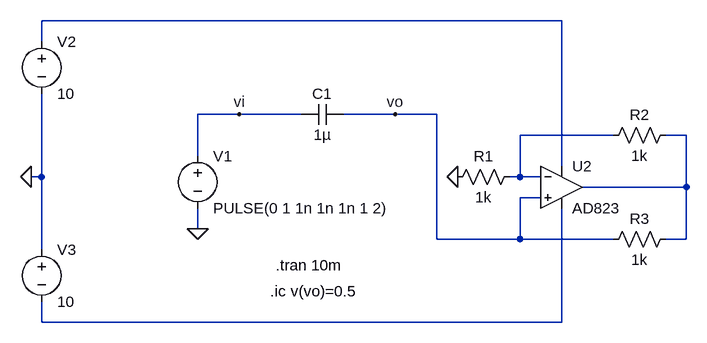
[diagram p0: schematic Q1.asc]
Q1.asc, the LTspice schematic file:
Version 4
SHEET 1 1064 680
WIRE 864 96 64 96
WIRE 64 128 64 96
WIRE 368 240 304 240
WIRE 464 240 368 240
WIRE 608 240 528 240
WIRE 672 240 608 240
WIRE 944 272 800 272
WIRE 1056 272 1024 272
WIRE 304 304 304 240
WIRE 864 320 864 96
WIRE 64 336 64 208
WIRE 64 336 48 336
WIRE 800 336 800 272
WIRE 800 336 784 336
WIRE 832 336 800 336
WIRE 1056 352 1056 272
WIRE 1056 352 896 352
WIRE 832 368 800 368
WIRE 304 416 304 384
WIRE 672 432 672 240
WIRE 800 432 800 368
WIRE 800 432 672 432
WIRE 944 432 800 432
WIRE 1056 432 1056 352
WIRE 1056 432 1024 432
WIRE 64 448 64 336
WIRE 64 560 64 528
WIRE 864 560 864 384
WIRE 864 560 64 560
FLAG 304 416 0
FLAG 368 240 vi
FLAG 608 240 vo
FLAG 704 336 0
FLAG 48 336 0
SYMBOL voltage 304 288 R0
SYMATTR InstName V1
SYMATTR Value PULSE(0 1 1n 1n 1n 1 2)
SYMBOL cap 528 224 R90
WINDOW 0 0 32 VBottom 2
WINDOW 3 32 32 VTop 2
SYMATTR InstName C1
SYMATTR Value 1µ
SYMBOL OpAmps/AD823 864 288 R0
SYMATTR InstName U2
SYMBOL Voltage 64 112 R0
SYMATTR InstName V2
SYMATTR Value 10
SYMBOL Voltage 64 432 R0
SYMATTR InstName V3
SYMATTR Value 10
SYMBOL Res 800 320 R90
WINDOW 0 0 56 VBottom 2
WINDOW 3 32 56 VTop 2
SYMATTR InstName R1
SYMATTR Value 1k
SYMBOL Res 1040 256 R90
WINDOW 0 0 56 VBottom 2
WINDOW 3 32 56 VTop 2
SYMATTR InstName R2
SYMATTR Value 1k
SYMBOL Res 1040 416 R90
WINDOW 0 0 56 VBottom 2
WINDOW 3 32 56 VTop 2
SYMATTR InstName R3
SYMATTR Value 1k
TEXT 424 472 Left 2 !.tran 10m
TEXT 416 512 Left 2 !.ic v(vo)=0.5

The netlist it stands for:
* Q1.asc
V1 vi 0 PULSE(0 1 1n 1n 1n 1 2)
C1 vo vi 1µ
XU2 vo N002 N001 N004 N003 AD823  ; pins In+ In- V+ V- OUT
V2 N001 0 10
V3 0 N004 10
R1 N002 0 1k
R2 N003 N002 1k
R3 N003 vo 1k
.tran 10m
.ic v(vo)=0.5
.lib ADI.lib
.backanno
.end